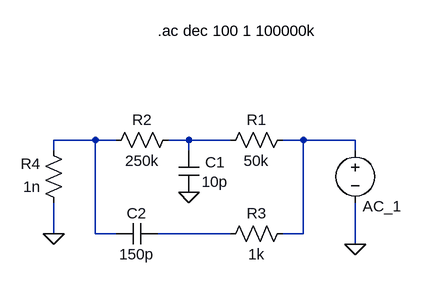
[diagram p0: schematic f(s).asc]
f(s).asc, the LTspice schematic file:
Version 4
SHEET 1 3216 2012
WIRE -464 -128 -528 -128
WIRE -432 -128 -464 -128
WIRE -320 -128 -352 -128
WIRE -256 -128 -320 -128
WIRE -144 -128 -176 -128
WIRE -64 -128 -144 -128
WIRE -528 -112 -528 -128
WIRE -320 -112 -320 -128
WIRE -64 -112 -64 -128
WIRE -528 16 -528 -32
WIRE -464 16 -464 -128
WIRE -432 16 -464 16
WIRE -256 16 -368 16
WIRE -144 16 -144 -128
WIRE -144 16 -176 16
WIRE -64 32 -64 -32
FLAG -320 -48 0
FLAG -64 32 0
FLAG -528 16 0
SYMBOL res -336 -144 R90
WINDOW 0 0 56 VBottom 2
WINDOW 3 32 56 VTop 2
SYMATTR InstName R2
SYMATTR Value 250k
SYMBOL res -160 -144 R90
WINDOW 0 0 56 VBottom 2
WINDOW 3 32 56 VTop 2
SYMATTR InstName R1
SYMATTR Value 50k
SYMBOL cap -304 -48 R180
WINDOW 0 -40 46 Left 2
WINDOW 3 -44 16 Left 2
SYMATTR InstName C1
SYMATTR Value 10p
SYMBOL cap -368 0 R90
WINDOW 0 0 32 VBottom 2
WINDOW 3 32 32 VTop 2
SYMATTR InstName C2
SYMATTR Value 150p
SYMBOL res -160 0 R90
WINDOW 0 0 56 VBottom 2
WINDOW 3 32 56 VTop 2
SYMATTR InstName R3
SYMATTR Value 1k
SYMBOL res -512 -16 R180
WINDOW 0 36 76 Left 2
WINDOW 3 36 40 Left 2
SYMATTR InstName R4
SYMATTR Value 1n
SYMBOL voltage -64 -128 R0
WINDOW 0 11 102 Left 2
SYMATTR InstName AC_1
SYMATTR Value ""
SYMATTR Value2 AC 1
TEXT -368 -296 Left 2 !.ac dec 100 1 100000k

The netlist it stands for:
* f(s).asc
R2 N002 N001 250k
R1 N003 N002 50k
C1 0 N002 10p
C2 N004 N001 150p
R3 N003 N004 1k
R4 0 N001 1n
V§AC_1 N003 0 AC 1
.ac dec 100 1 100000k
.backanno
.end